# Altium project SAMA5D27-SOM1-EK1_ REVD1.PrjPcb (part 1 of 6)
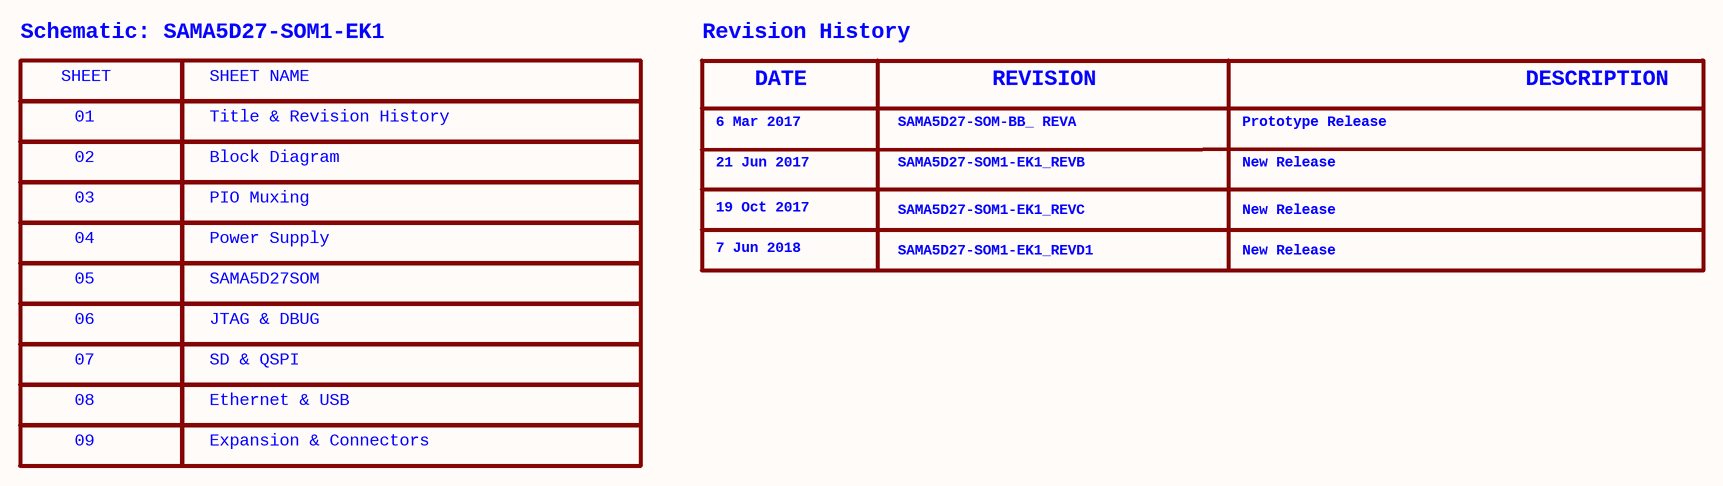
[diagram p0: 01) Title & Revision Hi.SchDoc]
ProjectBoardNumber: 10759; ProjectDrawnBy: Dragos Danaila; ProjectEngineer: Dragos Danaila; ProjectPartNumber: SAMA5D27-SOM1-EK1; ProjectRevisionART: D1; ProjectRevisionASSY: D1; ProjectRevisionFAB: D1; ProjectRevisionSCH: D1; ProjectTitle: SAMA5D27-SOM1-EK1
9 sheets, 305 parts. Net scope: global (net labels, ports and power ports of the same name join across sheets).
Board file: ATM1099C-0627-ssy-5.PcbDoc
Sheets:
  01) Title & Revision Hi.SchDoc
  02) Block Diagram.SchDoc
  03) PIO Muxing.SchDoc
  04) Power Supply.SchDoc
  05) SAMA5D27SOM.SchDoc
  06) JTAG & DBUG.SchDoc
  07) SD & QSPI.SchDoc
  08) Ethernet & USB.SchDoc
  09) Expansion & Connect.SchDoc

## Sheet 01) Title & Revision Hi.SchDoc
size B; CompanyName: Microchip Technology Inc.; Organization: Microchip Technology; Address1: 2355 West Chandler Blvd.; Address2: Chandler, AZ  85224; Address4: USA; DocumentNumber: 1; SheetNumber: 1; SheetTotal: 9; SheetTitle: **; Time: Time

### Parts
(Parts that share a designator on the sheet are numbered #1, #2 ... from top to bottom, then left to right.)
?#1  (no value)  (graphical)

### Notes on the sheet
- Schematic: SAMA5D27-SOM1-EK1
- SHEET
- SHEET NAME
- Revision History
- 01
- Title & Revision History
- 6 Mar 2017
- DATE
- SAMA5D27-SOM-BB_ REVA
- REVISION
- Prototype Release
- DESCRIPTION
- 03
- 02
- PIO Muxing
- Block Diagram
- 21 Jun 2017
- 19 Oct 2017
- SAMA5D27-SOM1-EK1_REVB
- SAMA5D27-SOM1-EK1_REVC
- New Release
- 05
- 04
- Power Supply
- SAMA5D27SOM
- 7 Jun 2018
- SAMA5D27-SOM1-EK1_REVD1
- 06
- JTAG & DBUG
- 08
- 07
- SD & QSPI
- Ethernet & USB
- 09
- Expansion & Connectors
- Drawn By:
- Engineer:
- PartNumber:
- Project Title
- Sheet Title
- Size
- B
- Revision:
- Sch #:
- Date:
- Sheet
- Designed with
- Altium.com <http://go.altium.com/MicrochipLandingPage_Evaluation.html>
- File:

### Library data of the parts
?#1 = Title Block B

## Sheet 02) Block Diagram.SchDoc
size C; SheetTitle: **; CompanyName: Microchip Technology Inc.; Organization: Microchip Technology; Address1: 2355 West Chandler Blvd.; Address2: Chandler, AZ  85224; Address4: USA; DocumentNumber: 2; SheetNumber: 2; SheetTotal: 9; Time: Time
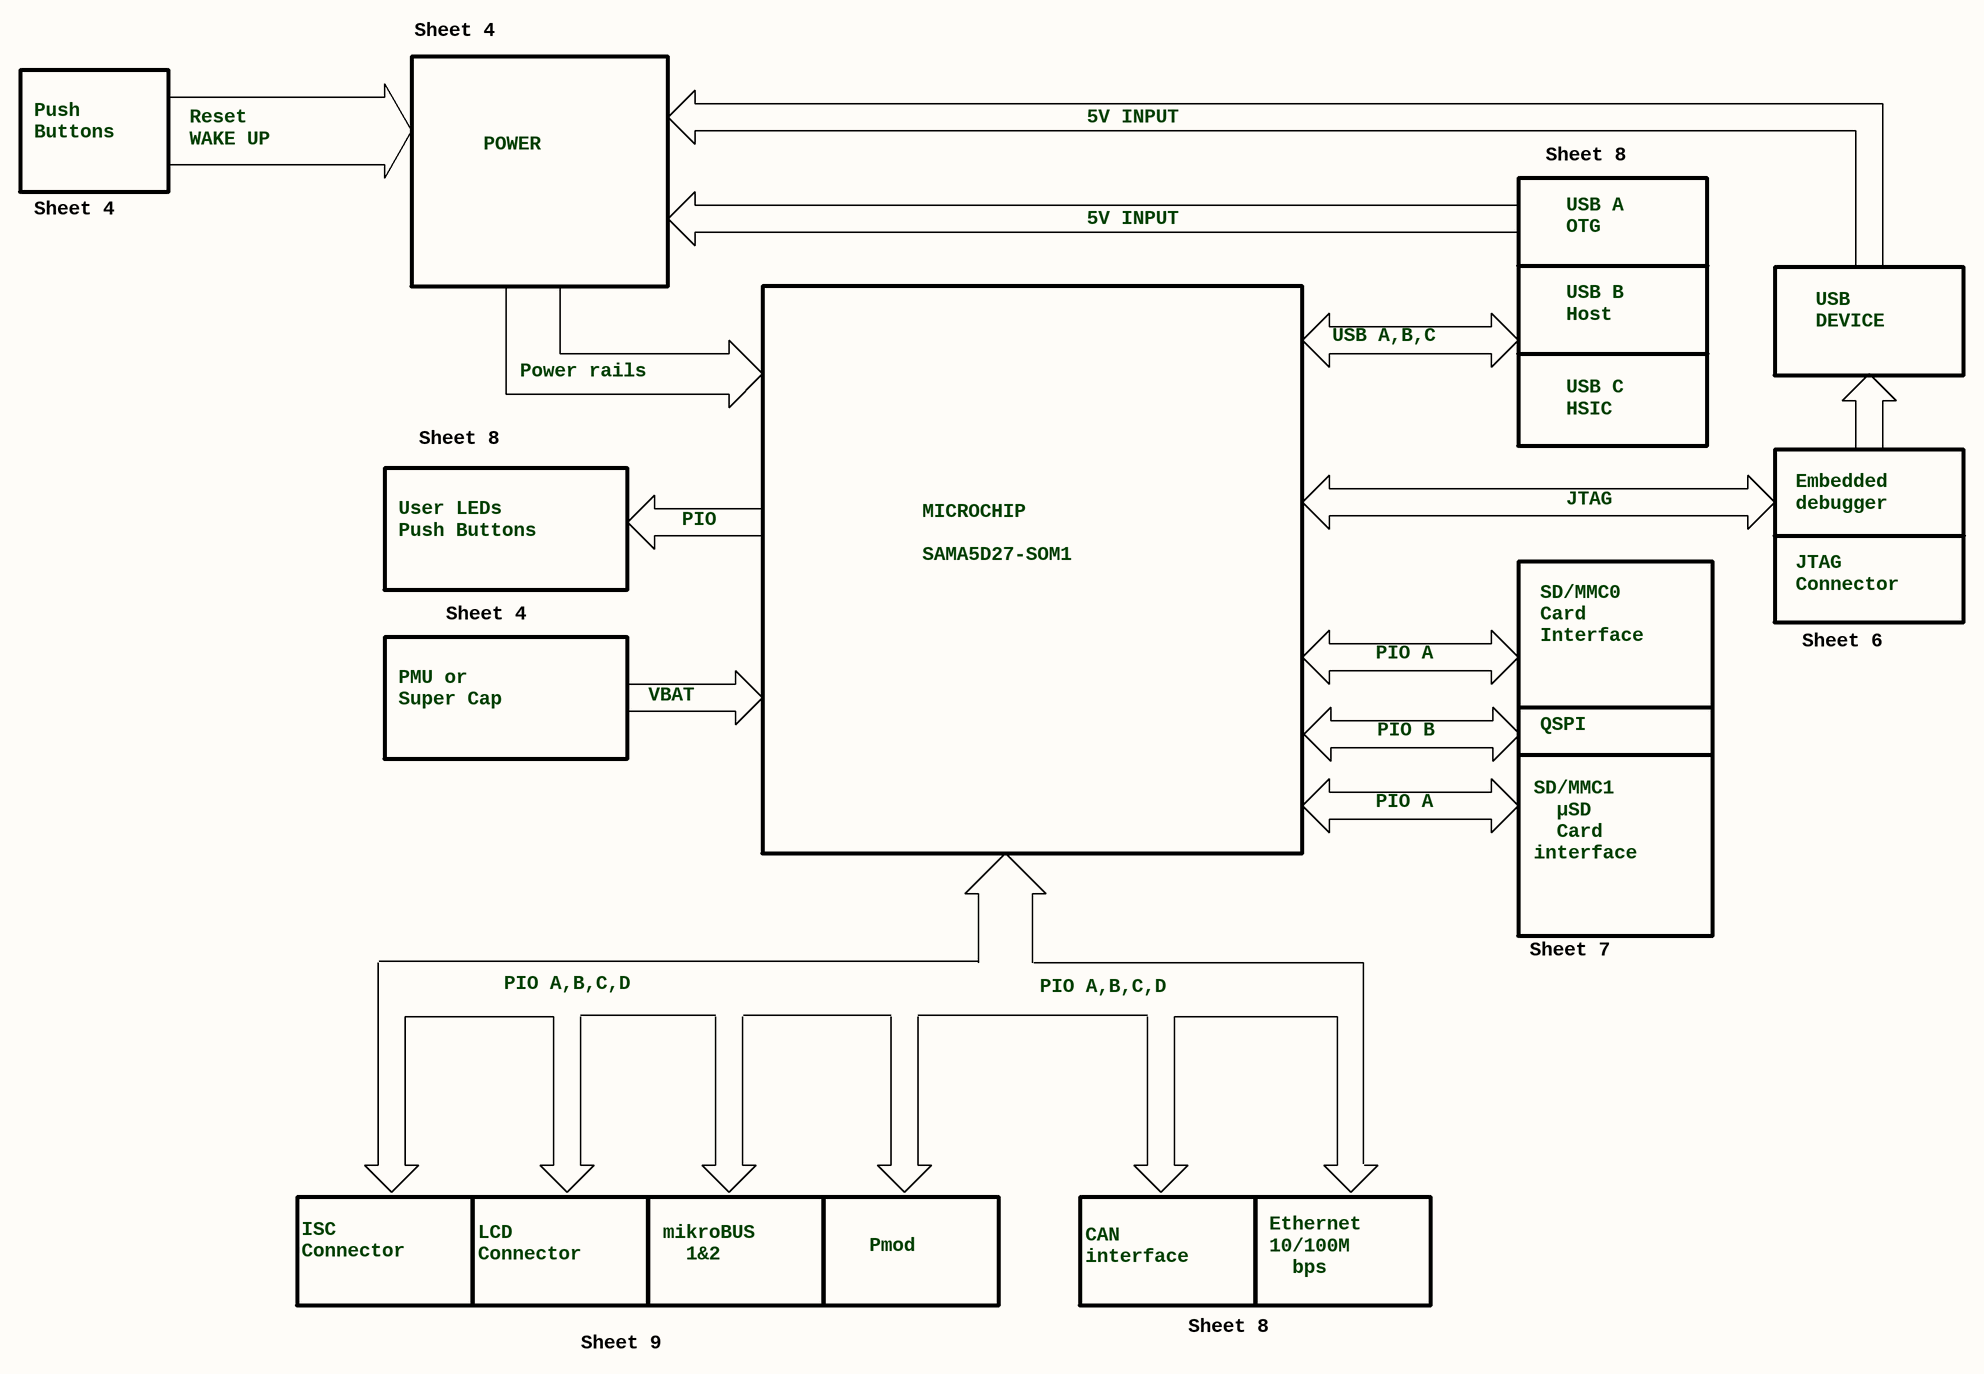
[diagram p1: 02) Block Diagram.SchDoc]

### Parts
(Parts that share a designator on the sheet are numbered #1, #2 ... from top to bottom, then left to right.)
?#2  (no value)  (graphical)

### Notes on the sheet
- Sheet 4
- Push
  Buttons
- Reset
  WAKE UP
- POWER
- 5V INPUT
- Sheet 8
- USB A
  OTG
- USB A,B,C
- USB B
  Host
- USB
  DEVICE
- Power rails
- USB C
  HSIC
- User LEDs
  Push Buttons
- PIO
- JTAG
- Embedded
  debugger
- JTAG
  Connector
- MICROCHIP
  SAMA5D27-SOM1
- PIO A
- SD/MMC0
  Card
  Interface
- Sheet 6
- PMU or
  Super Cap
- VBAT
- PIO B
- QSPI
- SD/MMC1
  µSD
  Card
  interface
- Sheet 7
- PIO A,B,C,D
- ISC
  Connector
- LCD
  Connector
- mikroBUS
  1&2
- Pmod
- CAN
  interface
- Ethernet
  10/100M
  bps
- Sheet 9
- Drawn By:
- Sheet Title
- Engineer:
- PartNumber:
- Project Title
- Designed with
- File:
- Size
- C
- Revision:
- Sch #:
- Date:
- Sheet
- Altium.com <http://go.altium.com/MicrochipLandingPage_Evaluation.html>

### Library data of the parts
?#2 = Title Block C

## Sheet 03) PIO Muxing.SchDoc
size C; SheetTitle: **; CompanyName: Microchip Technology Inc.; Organization: Microchip Technology; Address1: 2355 West Chandler Blvd.; Address2: Chandler, AZ  85224; Address4: USA; DocumentNumber: 3; SheetNumber: 3; SheetTotal: 9; Time: Time
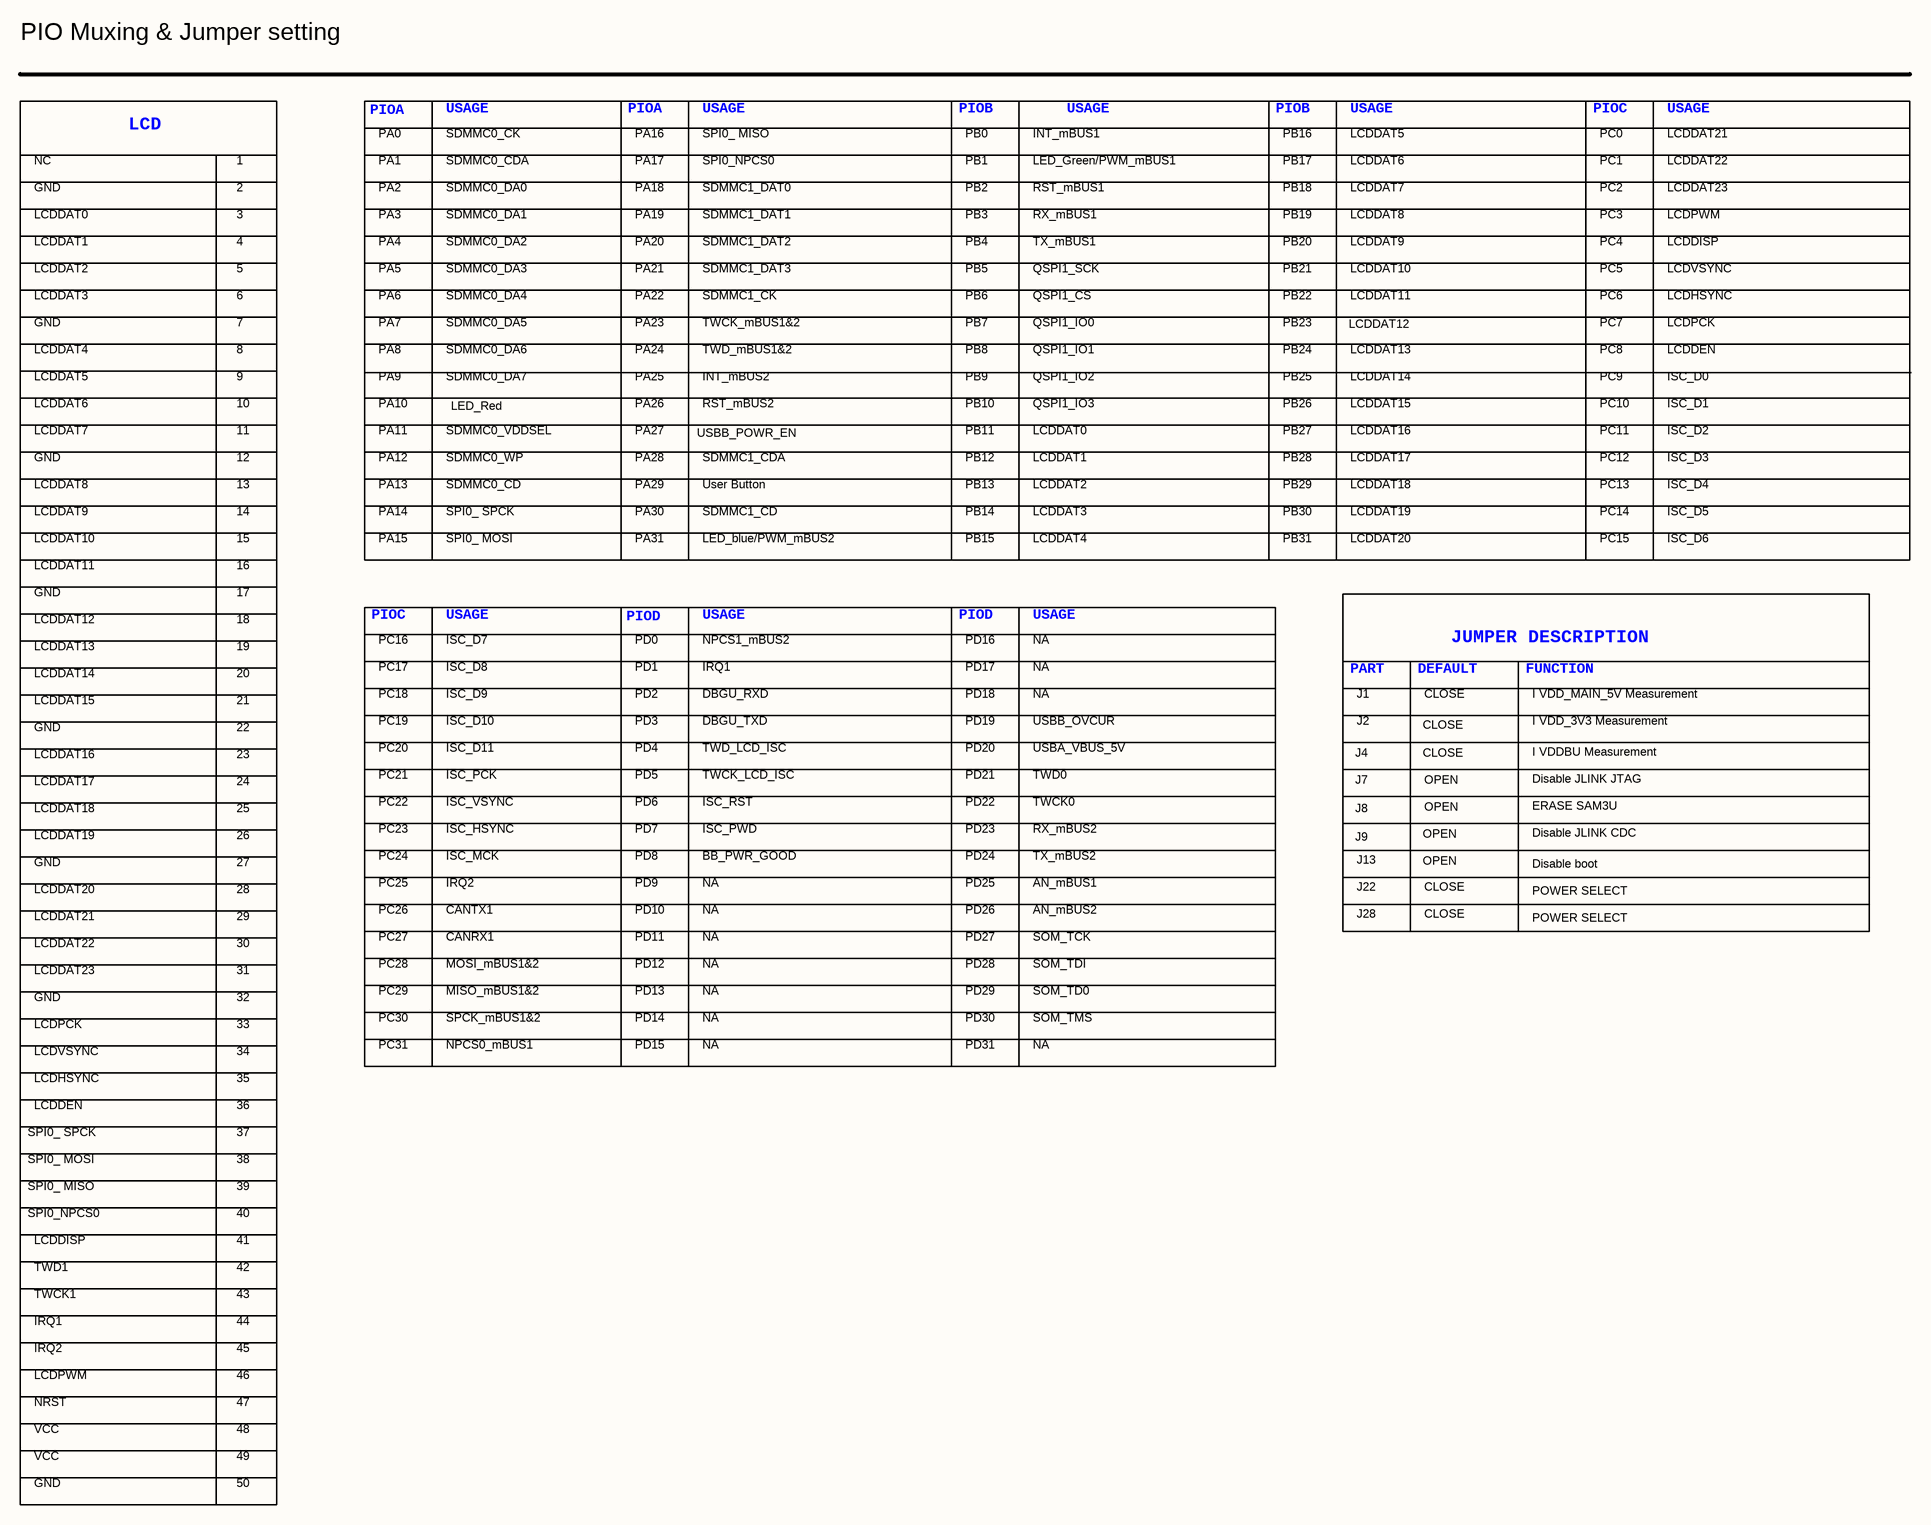
[diagram p2: 03) PIO Muxing.SchDoc]

### Parts
(Parts that share a designator on the sheet are numbered #1, #2 ... from top to bottom, then left to right.)
?#3  (no value)  (graphical)

### Notes on the sheet
- PIO Muxing & Jumper setting
- LCD
- PIOA
- PA0
- SDMMC0_CK
- USAGE
- PA16
- SPI0_ MISO
- PIOB
- PB0
- INT_mBUS1
- PB16
- LCDDAT5
- PIOC
- PC0
- LCDDAT21
- NC
- LCDDAT0
- GND
- 1
- 2
- 3
- PA1
- PA2
- PA3
- SDMMC0_CDA
- SDMMC0_DA1
- SDMMC0_DA0
- PA17
- PA18
- PA19
- SPI0_NPCS0
- SDMMC1_DAT1
- SDMMC1_DAT0
- PB3
- PB1
- PB2
- LED_Green/PWM_mBUS1
- RX_mBUS1
- RST_mBUS1
- PB17
- PB18
- PB19
- LCDDAT6
- LCDDAT8
- LCDDAT7
- PC1
- PC2
- PC3
- LCDPWM
- LCDDAT23
- LCDDAT22
- LCDDAT1
- LCDDAT2
- 4
- 5
- PA4
- PA5
- SDMMC0_DA3
- SDMMC0_DA2
- PA21
- PA20
- SDMMC1_DAT3
- SDMMC1_DAT2
- PB4
- PB5
- QSPI1_SCK
- TX_mBUS1
- PB21
- PB20
- LCDDAT10
- LCDDAT9
- PC5
- PC4
- LCDVSYNC
- LCDDISP
- LCDDAT3
- LCDDAT4
- 6
- 7
- 8
- PA6
- PA7
- PA8
- SDMMC0_DA5
- SDMMC0_DA4
- SDMMC0_DA6
- PA24
- PA23
- PA22
- TWCK_mBUS1&2
- SDMMC1_CK
- TWD_mBUS1&2
- PB6
- PB7
- PB8
- QSPI1_IO0
- QSPI1_CS
- QSPI1_IO1
- PB22
- PB23
- PB24
- LCDDAT12
- LCDDAT11
- LCDDAT13
- PC7
- PC8
- PC6
- LCDDEN
- LCDPCK
- LCDHSYNC
- 9
- 10
- PA9
- PA10
- SDMMC0_DA7
- LED_Red
- PA26
- PA25
- RST_mBUS2
- INT_mBUS2
- PB10
- PB9
- QSPI1_IO2
- QSPI1_IO3
- PB26
- PB25
- LCDDAT15
- LCDDAT14
- PC9
- PC10
- ISC_D1
- ISC_D0
- 11
- 12
- 13
- PA11
- PA12
- PA13
- SDMMC0_WP
- SDMMC0_VDDSEL
- SDMMC0_CD
- PA27
- PA29
- PA28
- USBB_POWR_EN
- SDMMC1_CDA
- User Button
- PB13
- PB12
- PB11
- PB29
- PB28
- PB27
- LCDDAT17
- LCDDAT16
- LCDDAT18
- PC11
- PC12
- PC13
- ISC_D4
- ISC_D2
- ISC_D3
- 14
- 15
- PA14
- PA15
- SPI0_ MOSI
- SPI0_ SPCK
- PA31
- PA30
- LED_blue/PWM_mBUS2
- SDMMC1_CD
- PB15
- PB14
- PB30
- PB31
- LCDDAT20
- LCDDAT19
- PC14
- PC15
- ISC_D6
- ISC_D5
- 16
- 17
- 18
- PIOD
- 19
- 20
- PC16
- PC17
- PC18
- ISC_D9
- ISC_D8
- ISC_D7
- PD0
- PD2
- PD1
- IRQ1
- DBGU_RXD
- NPCS1_mBUS2
- PD16
- PD17
- PD18
- NA
- PART
- J1
- DEFAULT
- CLOSE
- JUMPER DESCRIPTION
- FUNCTION
- I VDD_MAIN_5V Measurement
- 21
- 22
- 23
- PC19
- PC20
- ISC_D11
- ISC_D10
- PD3
- PD4
- DBGU_TXD
- TWD_LCD_ISC
- PD19
- PD20
- USBB_OVCUR
- USBA_VBUS_5V
- J4
- J2
- I VDD_3V3 Measurement
- I VDDBU Measurement
- 24
- 25
- PC21
- PC22
- PC23
- ISC_PCK
- ISC_HSYNC
- ISC_VSYNC
- PD5
- PD6
- PD7
- TWCK_LCD_ISC
- ISC_RST
- ISC_PWD
- PD21
- PD23
- PD22
- TWD0
- TWCK0
- RX_mBUS2
- J7
- J8
- OPEN
- Disable JLINK JTAG
- Disable JLINK CDC
- ERASE SAM3U
- 26
- 27
- 28
- PC24
- PC25
- IRQ2
- ISC_MCK
- PD8
- PD9
- BB_PWR_GOOD
- PD24
- PD25
- AN_mBUS1
- TX_mBUS2
- J9
- J13
- J22
- Disable boot
- POWER SELECT
- 29
- 30
- PC26
- PC27
- PC28
- CANRX1
- MOSI_mBUS1&2
- CANTX1
- PD10
- PD12
- PD11
- PD26
- PD27
- PD28
- SOM_TDI
- SOM_TCK
- AN_mBUS2
- J28
- 31
- 32
- 33
- PC29
- PC30
- SPCK_mBUS1&2
- MISO_mBUS1&2
- PD13
- PD14
- PD30
- PD29
- SOM_TMS
- SOM_TD0
- 34
- 35
- PC31
- NPCS0_mBUS1
- PD15
- PD31
- 36
- 37
- 38
- 39
- 40
- TWD1
- TWCK1
- 41
- 42
- 43
- 44
- 45
- VCC
- NRST
- 46
- 47
- 48
- 49
- 50
- Drawn By:
- Sheet Title
- Engineer:
- PartNumber:
- Project Title
- Designed with
- File:
- Size
- C
- Revision:
- Sch #:
- Date:
- Sheet
- Altium.com <http://go.altium.com/MicrochipLandingPage_Evaluation.html>

### Library data of the parts
?#3 = Title Block C

## Sheet 04) Power Supply.SchDoc
size B; CompanyName: Microchip Technology Inc.; Organization: Microchip Technology; Address1: 2355 West Chandler Blvd.; Address2: Chandler, AZ  85224; Address4: USA; DocumentNumber: 4; SheetNumber: 4; SheetTotal: 9; SheetTitle: **; Time: Time
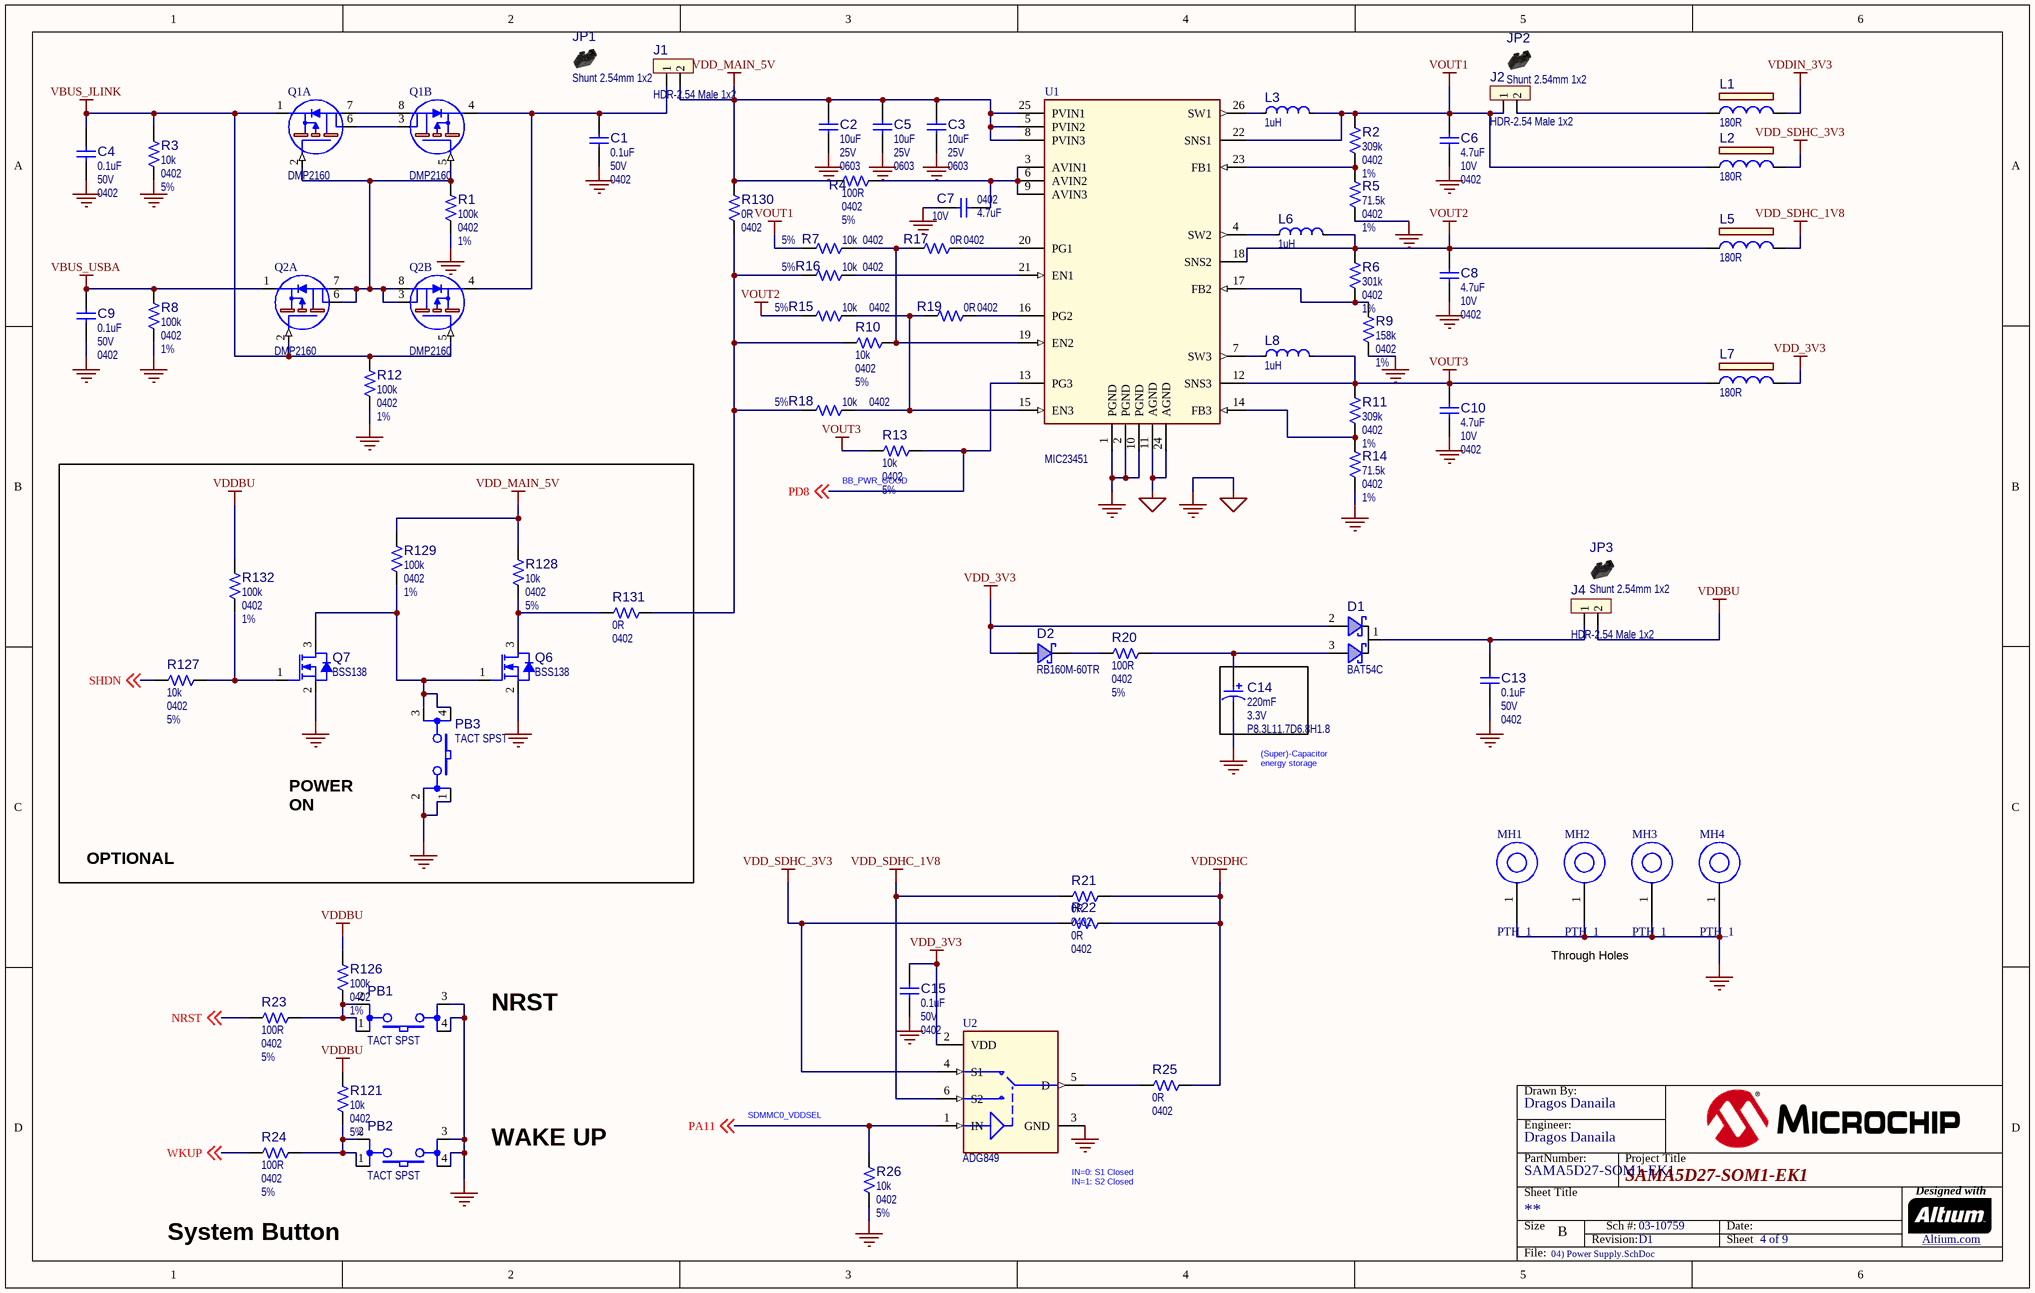
[diagram p3: 04) Power Supply.SchDoc]

### Parts
(Parts that share a designator on the sheet are numbered #1, #2 ... from top to bottom, then left to right.)
?#4  (no value)  (graphical)
C1  value 0.1uF  Voltage: 50V  Package: 0402  [CAP_C_0402]  (hidden comment: Capacitor NP)
C2  value 10uF  Voltage: 25V  Package: 0603  [CAP_C_0603]  (hidden comment: Capacitor NP)
C3  value 10uF  Voltage: 25V  Package: 0603  [CAP_C_0603]  (hidden comment: Capacitor NP)
C4  value 0.1uF  Voltage: 50V  Package: 0402  [CAP_C_0402]  (hidden comment: Capacitor NP)
C5  value 10uF  Voltage: 25V  Package: 0603  [CAP_C_0603]  (hidden comment: Capacitor NP)
C6  value 4.7uF  Voltage: 10V  Package: 0402  [CAP_C_0402]  (hidden comment: Capacitor NP)
C7  value 4.7uF  Voltage: 10V  Package: 0402  [CAP_C_0402]  (hidden comment: Capacitor NP)
C8  value 4.7uF  Voltage: 10V  Package: 0402  [CAP_C_0402]  (hidden comment: Capacitor NP)
C9  value 0.1uF  Voltage: 50V  Package: 0402  [CAP_C_0402]  (hidden comment: Capacitor NP)
C10  value 4.7uF  Voltage: 10V  Package: 0402  [CAP_C_0402]  (hidden comment: Capacitor NP)
C13  value 0.1uF  Voltage: 50V  Package: 0402  [CAP_C_0402]  (hidden comment: Capacitor NP)
C14  value 220mF  Voltage: 3.3V  Package: P8.3L11.7D6.8H1.8  [CAP_AX_P8.3L11.7D6.8H1.8]  (hidden comment: Capacitor POL)
C15  value 0.1uF  Voltage: 50V  Package: 0402  [CAP_C_0402]  (hidden comment: Capacitor NP)
D1  value BAT54C  [SOT-23-3_REVERSED]  (hidden comment: Diode Schottky Dual CK-1)
D2  value RB160M-60TR  [SOD-123FL]  (hidden comment: Diode Schottky)
J1  value HDR-2.54 Male 1x2  [HDR_M_2.54_1x2]  (hidden comment: Header 1x2)
J2  value HDR-2.54 Male 1x2  [HDR_M_2.54_1x2]  (hidden comment: Header 1x2)
J4  value HDR-2.54 Male 1x2  [HDR_M_2.54_1x2]  (hidden comment: Header 1x2)
JP1  value Shunt 2.54mm 1x2  [Jumper_Mechanical]  (hidden comment: Jumper Mechanical)  (mechanical)
JP2  value Shunt 2.54mm 1x2  [Jumper_Mechanical]  (hidden comment: Jumper Mechanical)  (mechanical)
JP3  value Shunt 2.54mm 1x2  [Jumper_Mechanical]  (hidden comment: Jumper Mechanical)  (mechanical)
L1  value 180R  [IND_C_0603]  (hidden comment: Ferrite Bead)
L2  value 180R  [IND_C_0603]  (hidden comment: Ferrite Bead)
L3  value 1uH  [IND_C_1210]  (hidden comment: Inductor)
L5  value 180R  [IND_C_0603]  (hidden comment: Ferrite Bead)
L6  value 1uH  [IND_C_1210]  (hidden comment: Inductor)
L7  value 180R  [IND_C_0603]  (hidden comment: Ferrite Bead)
L8  value 1uH  [IND_C_1210]  (hidden comment: Inductor)
MH1  PTH_1  [HOLE2]  (no BOM)
MH2  PTH_1  [HOLE2]  (no BOM)
MH3  PTH_1  [HOLE2]  (no BOM)
MH4  PTH_1  [HOLE2]  (no BOM)
PB1  value TACT SPST  [SW_SMD_6mmX6mm_TL3301]  (hidden comment: Switch 4 Pin)
PB2  value TACT SPST  [SW_SMD_6mmX6mm_TL3301]  (hidden comment: Switch 4 Pin)
PB3  value TACT SPST  [SW_SMD_6mmX6mm_TL3301]  (hidden comment: Switch 4 Pin)
Q1  value DMP2160  [U-DFN2020-6_2.0x2.0]  (hidden comment: Transistor U-DFN2020-6-SGDSGD)  (parts A,B of 2)
Q2  value DMP2160  [U-DFN2020-6_2.0x2.0]  (hidden comment: Transistor U-DFN2020-6-SGDSGD)  (parts A,B of 2)
Q6  value BSS138  [SOT-23-3]  (hidden comment: Transistor MOS-N GSD)
Q7  value BSS138  [SOT-23-3]  (hidden comment: Transistor MOS-N GSD)
R1  value 100k  Package: 0402  Tolerance: 1%  [RES_C_0402]  (hidden comment: Resistor)
R2  value 309k  Package: 0402  Tolerance: 1%  [RES_C_0402]  (hidden comment: Resistor)
R3  value 10k  Package: 0402  Tolerance: 5%  [RES_C_0402]  (hidden comment: Resistor)
R4  value 100R  Package: 0402  Tolerance: 5%  [RES_C_0402]  (hidden comment: Resistor)
R5  value 71.5k  Package: 0402  Tolerance: 1%  [RES_C_0402]  (hidden comment: Resistor)
R6  value 301k  Package: 0402  Tolerance: 1%  [RES_C_0402]  (hidden comment: Resistor)
R7  value 10k  Package: 0402  Tolerance: 5%  [RES_C_0402]  (hidden comment: Resistor)
R8  value 100k  Package: 0402  Tolerance: 1%  [RES_C_0402]  (hidden comment: Resistor)
R9  value 158k  Package: 0402  Tolerance: 1%  [RES_C_0402]  (hidden comment: Resistor)
R10  value 10k  Package: 0402  Tolerance: 5%  [RES_C_0402]  (hidden comment: Resistor)
R11  value 309k  Package: 0402  Tolerance: 1%  [RES_C_0402]  (hidden comment: Resistor)
R12  value 100k  Package: 0402  Tolerance: 1%  [RES_C_0402]  (hidden comment: Resistor)
R13  value 10k  Package: 0402  Tolerance: 5%  [RES_C_0402]  (hidden comment: Resistor)
R14  value 71.5k  Package: 0402  Tolerance: 1%  [RES_C_0402]  (hidden comment: Resistor)
R15  value 10k  Package: 0402  Tolerance: 5%  [RES_C_0402]  (hidden comment: Resistor)
R16  value 10k  Package: 0402  Tolerance: 5%  [RES_C_0402]  (hidden comment: Resistor)
R17  value 0R  Package: 0402  [RES_C_0402]  (hidden comment: Resistor)
R18  value 10k  Package: 0402  Tolerance: 5%  [RES_C_0402]  (hidden comment: Resistor)
R19  value 0R  Package: 0402  [RES_C_0402]  (hidden comment: Resistor)
R20  value 100R  Package: 0402  Tolerance: 5%  [RES_C_0402]  (hidden comment: Resistor)
R21  value 0R  Package: 0402  [RES_C_0402]  (hidden comment: Resistor)
R22  value 0R  Package: 0402  [RES_C_0402]  (hidden comment: Resistor)
R23  value 100R  Package: 0402  Tolerance: 5%  [RES_C_0402]  (hidden comment: Resistor)
R24  value 100R  Package: 0402  Tolerance: 5%  [RES_C_0402]  (hidden comment: Resistor)
R25  value 0R  Package: 0402  [RES_C_0402]  (hidden comment: Resistor)
R26  value 10k  Package: 0402  Tolerance: 5%  [RES_C_0402]  (hidden comment: Resistor)
R121  value 10k  Package: 0402  Tolerance: 5%  [RES_C_0402]  (hidden comment: Resistor)
R126  value 100k  Package: 0402  Tolerance: 1%  [RES_C_0402]  (hidden comment: Resistor)
R127  value 10k  Package: 0402  Tolerance: 5%  [RES_C_0402]  (hidden comment: Resistor)
R128  value 10k  Package: 0402  Tolerance: 5%  [RES_C_0402]  (hidden comment: Resistor)
R129  value 100k  Package: 0402  Tolerance: 1%  [RES_C_0402]  (hidden comment: Resistor)
R130  value 0R  Package: 0402  [RES_C_0402]  (hidden comment: Resistor)
R131  value 0R  Package: 0402  [RES_C_0402]  (hidden comment: Resistor)
R132  value 100k  Package: 0402  Tolerance: 1%  [RES_C_0402]  (hidden comment: Resistor)
U1  value MIC23451  [VQFN-26_4X4_MIC23451]  (hidden comment: MIC23451 VQFN-26)
U2  value ADG849  [SC-70-6]  (hidden comment: ADG849 SC70)

### Blocks framed on the sheet
OPTIONAL: PB3 Q6 Q7 R127-R129 R131 R132

### Nets
GND_POWER: C1.2 C2.2 C3.2 C4.2 C5.2 C6.2 C7.2 C8.2 C9.2 C10.2 C13.2 C14.2 C15.2 MH1.1 MH2.1 MH3.1 MH4.1 PB1.3 PB1.4 PB2.3 PB2.4 PB3.1 PB3.2 Q6.2(S) Q7.2(S) R1.2 R3.1 R5.2 R8.2 R9.2 R12.2 R14.2 R26.1 U1.1(PGND) U1.2(PGND) U1.10(PGND) U1.11(AGND) U1.24(AGND) U2.3(GND)  [also labelled GND_SIGNAL]  [project net GND]
VBUS_JLINK: C4.1 Q1.1(S2) Q2.2(G2) Q2.5(G2) R3.2 R12.1
VBUS_USBA: C9.1 Q2.1(S2) R8.1
VDD_3V3: C15.1 D1.2(A) D2.1(A) L7.2 U2.2(VDD)
VDD_MAIN_5V: C2.1 C3.1 C5.1 J1.2 R4.1 R128.2 R129.1 R130.2 U1.5(PVIN2) U1.8(PVIN3) U1.25(PVIN1)
VDD_SDHC_1V8: L5.2 R21.1 U2.6(S2)
VDD_SDHC_3V3: L2.2 R22.1 U2.4(S1)
VDDBU: J4.2 R121.1 R126.1 R132.1
VDDIN_3V3: L1.2
VDDSDHC: R21.2 R22.2 R25.2
VOUT1: C6.1 J2.1 L2.1 L3.2(F) R2.1 R7.1 U1.22(SNS1)
VOUT2: C8.1 L5.1 L6.2(F) R6.1 R15.2 U1.18(SNS2)
VOUT3: C10.1 L7.1 L8.2(F) R11.1 R13.1 U1.12(SNS3)
NRST: R23.1 ; off-sheet NRST
PA11: R26.2 U2.1(IN) ; off-sheet PA11
PD8: R13.2 U1.13(PG3) ; off-sheet PD8
SHDN: R127.1 ; off-sheet SHDN
WKUP: R24.1 ; off-sheet WKUP
NetC1_1: C1.1 J1.1 Q1.4(S2) Q2.4(S2)
NetC7_1: C7.1 R4.2 U1.3(AVIN1) U1.6(AVIN2) U1.9(AVIN3)
NetC13_1: C13.1 D1.1(KK) J4.1
NetC14_1: C14.1 D1.3(A) R20.2
NetD2_2: D2.2(K) R20.1
NetJ2_2: J2.2 L1.1
NetL3_1: L3.1(S) U1.26(SW1)
NetL6_1: L6.1(S) U1.4(SW2)
NetL8_1: L8.1(S) U1.7(SW3)
NetPB1_1: PB1.1 PB1.2 R23.2 R126.2
NetPB2_1: PB2.1 PB2.2 R24.2 R121.2
NetPB3_3: PB3.3 PB3.4 Q6.1(G) Q7.3(D) R129.2
NetQ1_2: Q1.2(G2) Q1.5(G2) Q2.3(D2_1) Q2.6(D2_1) Q2.7(D2_2) Q2.8(D2_2) R1.1
NetQ1_3: Q1.3(D2_1) Q1.6(D2_1)
NetQ1_7: Q1.7(D2_2) Q1.8(D2_2)
NetQ6_3: Q6.3(D) R128.1 R131.1
NetQ7_1: Q7.1(G) R127.2 R132.2
NetR2_2: R2.2 R5.1 U1.23(FB1)
NetR6_2: R6.2 R9.1 U1.17(FB2)
NetR7_2: R7.2 R10.2 R17.1 U1.19(EN2)
NetR10_1: R10.1 R16.1 R18.2 R130.1 R131.2
NetR11_2: R11.2 R14.1 U1.14(FB3)
NetR15_1: R15.1 R18.1 R19.1 U1.15(EN3)
NetR16_2: R16.2 U1.21(EN1)
NetR17_2: R17.2 U1.20(PG1)
NetR19_2: R19.2 U1.16(PG2)
NetR25_1: R25.1 U2.5(D)

### Notes on the sheet
- (near R13) BB_PWR_GOOD
- (Super)-Capacitor
  energy storage
- (near PB3) POWER
  ON
- Through Holes
- NRST
- WAKE UP
- SDMMC0_VDDSEL
- System Button
- (near U2) IN=0: S1 Closed
  IN=1: S2 Closed
- Drawn By:
- Engineer:
- PartNumber:
- Project Title
- Sheet Title
- Size
- B
- Revision:
- Sch #:
- Date:
- Sheet
- Designed with
- Altium.com <http://go.altium.com/MicrochipLandingPage_Evaluation.html>
- File:

### Library data of the parts
?#4 = Title Block B
C1 C4 C9 C13 C15 = CAP1463: Capacitor; Manufacturer 1: TDK Corporation; Manufacturer Part Number 1: C1005X7R1H104K050BB; Description_: CAP CER 0.1uF 50V 10% X7R SMD 0402; Dev Tools Status: Production; Tolerance: 10%; Temperature Coeffcient: X7R; Type: Ceramic; Owner: Jamus Griego; Populated: YES; MCHP-ID: CAP1463; Revision: 1; Symbol: Capacitor NP; Status: MCL Design; ComponentLink1URL: https://chn-vm-apps.microchip.com/mchprepo/parts/Datasheets/TDKMLCCCapRange.pdf; ComponentLink1Description: SVN Datasheet; ComponentLink2URL: C:\ALTIUM_WORK\00001_MCHP-CDB\Datasheets\TDKMLCCCapRange.pdf; ComponentLink2Description: Local Datasheet; ComponentLink3URL: C:\ALTIUM_WORK\00001_MCHP-CDB\Library\LibraryRefs\Capacitor NP.SchLib; ComponentLink3Description: Open Symbol; ComponentLink4URL: C:\ALTIUM_WORK\00001_MCHP-CDB\Library\Footprints\CAP_C_0402.PcbLib; ComponentLink4Description: Open Footprint; ComponentLink5Description: Open Footprint 2; ComponentLink6Description: Open Footprint 3; ComponentLink7Description: Open Footprint 4; Operating Temperature: -55C to +125C; Category: Capacitor; Supplier 1: Digi-Key; Supplier Part Number 1: 445-5932-1-ND; Quantity Override: 1
C2 C3 C5 = CAP1650: Capacitor; Manufacturer 1: TDK Corporation; Manufacturer Part Number 1: C1608X5R1E106M080AC; Description_: CAP CER 10uF 25V 20% X5R SMD 0603; Dev Tools Status: Design; Tolerance: 20%; Temperature Coeffcient: X5R; Type: Ceramic; Owner: Razvan Cristescu; Populated: YES; MCHP-ID: CAP1650; Revision: A; Symbol: Capacitor NP; Status: MCL Design; ComponentLink1URL: https://chn-vm-apps.microchip.com/mchprepo/parts/Datasheets/1913358.pdf; ComponentLink1Description: SVN Datasheet; ComponentLink2URL: C:\ALTIUM_WORK\00001_MCHP-CDB\Datasheets\1913358.pdf; ComponentLink2Description: Local Datasheet; ComponentLink3URL: C:\ALTIUM_WORK\00001_MCHP-CDB\Library\LibraryRefs\Capacitor NP.SchLib; ComponentLink3Description: Open Symbol; ComponentLink4URL: C:\ALTIUM_WORK\00001_MCHP-CDB\Library\Footprints\CAP_C_0603.PcbLib; ComponentLink4Description: Open Footprint; ComponentLink5Description: Open Footprint 2; ComponentLink6Description: Open Footprint 3; ComponentLink7Description: Open Footprint 4; Operating Temperature: -55C to +85C; Category: Capacitor; Supplier 1: Farnell; Supplier Part Number 1: 2521968; Quantity Override: 1
C6-C8 C10 = CAP1684: Capacitor; Manufacturer 1: TDK Corporation; Manufacturer Part Number 1: C1005X5R1A475K050BC; Description_: CAP CER 4.7uF 10V 10% X5R SMD 0402; Dev Tools Status: Design; Tolerance: 10%; Temperature Coeffcient: X5R; Type: Ceramic; Owner: Jesus Aviles; Populated: YES; MCHP-ID: CAP1684; Revision: B; Symbol: Capacitor NP; Status: MCL Design; ComponentLink1Description: SVN Datasheet; ComponentLink2Description: Local Datasheet; ComponentLink3URL: C:\ALTIUM_WORK\00001_MCHP-CDB\Library\LibraryRefs\Capacitor NP.SchLib; ComponentLink3Description: Open Symbol; ComponentLink4URL: C:\ALTIUM_WORK\00001_MCHP-CDB\Library\Footprints\CAP_C_0402.PcbLib; ComponentLink4Description: Open Footprint; ComponentLink5Description: Open Footprint 2; ComponentLink6Description: Open Footprint 3; ComponentLink7Description: Open Footprint 4; Operating Temperature: -55C to 85C; Category: Capacitor; Supplier 1: Digi-Key; Supplier Part Number 1: 445-13820-1-ND; Quantity Override: 1
C14 = CAP1762: Capacitor; Manufacturer 1: Elna America; Manufacturer Part Number 1: DSK-3R3H204T614-H2L; Description_: CAP SUPERCAP 200mF 3.3V -20% +80% 200Ohm AX P8.3L11.7D6.8H1.8; Dev Tools Status: Design; Tolerance: -20%, +80%; ESR: 200R; Type: Supercap; Owner: Alexandru Chiser - M19201; Populated: YES; MCHP-ID: CAP1762; Revision: A; Symbol: Capacitor POL; Status: MCL Design; ComponentLink1URL: https://chn-vm-apps.microchip.com/mchprepo/parts/Datasheets/ds_e.pdf; ComponentLink1Description: SVN Datasheet; ComponentLink2URL: C:\ALTIUM_WORK\00001_MCHP-CDB\Datasheets\ds_e.pdf; ComponentLink2Description: Local Datasheet; ComponentLink3URL: C:\ALTIUM_WORK\00001_MCHP-CDB\Library\LibraryRefs\Capacitor POL.SchLib; ComponentLink3Description: Open Symbol; ComponentLink4URL: C:\ALTIUM_WORK\00001_MCHP-CDB\Library\Footprints\CAP_AX_P8.3L11.7D6.8H1.8.PcbLib; ComponentLink4Description: Open Footprint; ComponentLink5Description: Open Footprint 2; ComponentLink6Description: Open Footprint 3; ComponentLink7Description: Open Footprint 4; Operating Temperature: -10C to +60C; Category: Capacitor; Supplier 1: Digi-Key; Supplier Part Number 1: 604-1147-1-ND; Quantity Override: 1
D1 = DIODE0056: Manufacturer 1: Diodes Incorporated; Manufacturer Part Number 1: BAT54CTA; Description_: DIO SCTKYARR BAT54C 530mV 200mA 30V SOT-23-3; Dev Tools Status: Production; Type: Schottky Array; Forward Current: 200mA; Power: 330mW; Reverse Current: 2.5uA; Reverse Voltage: 30V; Populated: Yes; MCHP-ID: DIODE0056; Revision: 1; Symbol: Diode Schottky Dual CK-1; Status: MCL Design; Package: SOT-23-3; ComponentLink1URL: https://chn-vm-apps.microchip.com/mchprepo/parts/Datasheets/bat54srs.pdf; ComponentLink1Description: SVN Datasheet; ComponentLink2URL: C:\ALTIUM_WORK\00001_MCHP-CDB\Datasheets\bat54srs.pdf; ComponentLink2Description: Local Datasheet; ComponentLink3URL: C:\ALTIUM_WORK\00001_MCHP-CDB\Library\LibraryRefs\Diode Schottky Dual CK-1.SchLib; ComponentLink3Description: Open Symbol; ComponentLink4URL: C:\ALTIUM_WORK\00001_MCHP-CDB\Library\Footprints\SOT-23-3_REVERSED.PcbLib; ComponentLink4Description: Open Footprint; ComponentLink5Description: Open Footprint 2; ComponentLink6Description: Open Footprint 3; ComponentLink7Description: Open Footprint 4; Operating Temperature: -55C to +150C; Category: Diode; Supplier 1: Digi-Key; Supplier Part Number 1: BAT54CTR-ND; Quantity Override: 1; Manufacturer 2: Fairchild; Manufacturer Part Number 2: BAT54C; Manufacturer 3: Diodes Incorporated; Manufacturer Part Number 3: UBAT54CTA; Manufacturer 4: STMicroelectronics; Manufacturer Part Number 4: BAT54C; Supplier 2: Digi-Key; Supplier Part Number 2: BAT54CFSTR-ND; Supplier 3: Diodes Incorporated; Supplier Part Number 3: UBAT54CTA; Supplier 4: STMicroelectronics; Supplier Part Number 4: BAT54C
D2 = DIODE1357: DIO SCTKY RB160M-60TR 550mV 1A 60V SMD SOD-123F; Manufacturer 1: Rohm Semiconductor; Dev Tools Status: Design; Power: 1W; Reverse Current: 50uA; Reverse Recovery Time: 11.7ns; Owner: Dragos Danaila; Populated: YES; MCHP-ID: DIODE1357; Revision: A; Symbol: Diode Schottky; Description_: DIO SCTKY RB160M-60TR 550mV 1A 60V SMD SOD-123F; Status: MCL Design; Package: SOD-123-2; ComponentLink1URL: https://chn-vm-apps.microchip.com/mchprepo/parts/Datasheets/rb160m-60-210199.pdf; ComponentLink1Description: SVN Datasheet; ComponentLink2URL: C:\ALTIUM_WORK\00001_MCHP-CDB\Datasheets\rb160m-60-210199.pdf; ComponentLink2Description: Local Datasheet; ComponentLink3URL: C:\ALTIUM_WORK\00001_MCHP-CDB\Library\LibraryRefs\Diode Schottky.SchLib; ComponentLink3Description: Open Symbol; ComponentLink4URL: C:\ALTIUM_WORK\00001_MCHP-CDB\Library\Footprints\SOD-123FL.PcbLib; ComponentLink4Description: Open Footprint; ComponentLink5Description: Open Footprint 2; ComponentLink6Description: Open Footprint 3; ComponentLink7Description: Open Footprint 4; Operating Temperature: -40C to +150C; Category: Diode; Forward Current: 1A; Reverse Voltage: 60V; Manufacturer Part Number 1: RB160M-60TR; Supplier 1: Mouser; Supplier Part Number 1: 755-RB160M-60TR; Quantity Override: 1
J1 J2 J4 = CON1108: Manufacturer 1: FCI; Manufacturer Part Number 1: 77311-118-02LF; Description_: CON HDR-2.54 Male 1x2 Gold 5.84MH TH VERT; Dev Tools Status: Production; Owner: Bogdan P (M91398); Populated: Yes; MCHP-ID: CON1108; Revision: 1; Symbol: Header 1x2; Status: MCL Design; ComponentLink1URL: https://chn-vm-apps.microchip.com/mchprepo/parts/Datasheets/77311.pdf; ComponentLink1Description: SVN Datasheet; ComponentLink2URL: C:\ALTIUM_WORK\00001_MCHP-CDB\Datasheets\77311.pdf; ComponentLink2Description: Local Datasheet; ComponentLink3URL: C:\ALTIUM_WORK\00001_MCHP-CDB\Library\LibraryRefs\Header 1x2.SchLib; ComponentLink3Description: Open Symbol; ComponentLink4URL: C:\ALTIUM_WORK\00001_MCHP-CDB\Library\Footprints\HDR_M_2.54_1x2.PcbLib; ComponentLink4Description: Open Footprint; ComponentLink5Description: Open Footprint 2; ComponentLink6Description: Open Footprint 3; ComponentLink7Description: Open Footprint 4; Type: Header 2.54mm; Category: Connector; Manufacturer 2: FCI; Manufacturer Part Number 2: 68001-202HLF; Manufacturer 3: FCI; Manufacturer Part Number 3: 68000-202HLF; Manufacturer 4: Samtec; Manufacturer Part Number 4: TSW-102-07-G-S; Manufacturer 5: Sullins; Manufacturer Part Number 5: PBC02SAAN; Manufacturer 6: SPC Technology; Manufacturer Part Number 6: SPC20481; Manufacturer 7: Samtec; Manufacturer Part Number 7: TSW-102-07-F-S; Manufacturer 8: Nextron; Manufacturer Part Number 8: R-211-0211-0021-000; Manufacturer 9: Samtec; Manufacturer Part Number 9: TSW-102-07-S-S; Supplier 1: Digi-Key; Supplier Part Number 1: 609-4434-ND; Supplier 2: Digi-Key; Supplier Part Number 2: 609-3469-ND; Supplier 3: Digi-Key; Supplier Part Number 3: 609-3502-ND; Supplier 4: Digi-Key; Supplier Part Number 4: SAM1029-02-ND; Supplier 5: Digi-Key; Supplier Part Number 5: S1011E-02-ND; Supplier 6: Newark; Supplier Part Number 6: 93K5734; Supplier 7: Newark; Supplier Part Number 7: 79P3146; Supplier 8: Raynen; Supplier Part Number 8: R-211-0211-0021-000; Supplier 9: Samtec; Supplier Part Number 9: TSW-102-07-S-S; Quantity Override: 1
JP1-JP3 = HW1006: Manufacturer 1: 3M; Manufacturer Part Number 1: 969102-0000-DA; MCHP-ID: HW1006; Description_: MECH HW JUMPER 2.54mm 1x2; Dev Tools Status: Production; Owner: Mike Ragsdale; Populated: MECH; Revision: 1; Symbol: Jumper Mechanical; Status: MCL Design; ComponentLink1URL: https://chn-vm-apps.microchip.com/mchprepo/parts/Datasheets/63429.pdf; ComponentLink1Description: SVN Datasheet; ComponentLink2URL: C:\ALTIUM_WORK\00001_MCHP-CDB\Datasheets\63429.pdf; ComponentLink2Description: Local Datasheet; ComponentLink3URL: C:\ALTIUM_WORK\00001_MCHP-CDB\Library\LibraryRefs\Jumper Mechanical.SchLib; ComponentLink3Description: Open Symbol; ComponentLink4URL: C:\ALTIUM_WORK\00001_MCHP-CDB\Library\Footprints\Jumper_Mechanical.PcbLib; ComponentLink4Description: Open Footprint; ComponentLink5Description: Open Footprint 2; ComponentLink6Description: Open Footprint 3; ComponentLink7Description: Open Footprint 4; Type: Jumper; Category: Hardware; Manufacturer 2: FCI; Manufacturer Part Number 2: 63429-202LF; Manufacturer 3: Harwin; Manufacturer Part Number 3: M7567-05; Manufacturer 4: Sullins; Manufacturer Part Number 4: SSC02SYAN; Manufacturer 5: Tyco Electronics (TE Connectivity); Manufacturer Part Number 5: 382811-6; Manufacturer 6: Tyco Electronics (TE Connectivity); Manufacturer Part Number 6: 2-382811-1; Manufacturer 7: Samtec; Manufacturer Part Number 7: SNT-100-BK-G; Manufacturer 8: Sullins Connector Solutions; Manufacturer Part Number 8: STC02SYAN; Manufacturer 9: Sullins Connector Solutions; Manufacturer Part Number 9: SPC02SVGN-RC; Supplier 1: Digi-Key; Supplier Part Number 1: 3M9580-ND; Supplier 2: Digi-Key; Supplier Part Number 2: 609-2997-ND; Supplier 3: Digi-Key; Supplier Part Number 3: M7567-05-ND; Supplier 4: Digi-Key; Supplier Part Number 4: S9002-ND; Supplier 5: Digi-Key; Supplier Part Number 5: A26227-ND; Supplier 6: Digi-Key; Supplier Part Number 6: A31697-ND; Supplier 7: Samtec; Supplier Part Number 7: SNT-100-BK-G; Supplier 8: Digi-Key; Supplier Part Number 8: S9000-ND; Supplier 9: Digi-Key; Supplier Part Number 9: S9338-ND; Quantity Override: 1
L1 L2 L5 L7 = IND1453: FERRITE 180R 1.5A SMD 0603; Manufacturer 1: Murata Electronics North America; Manufacturer Part Number 1: BLM18PG181SN1D; Dev Tools Status: Design; Owner: Dragos Danaila; DCR: 0.09R; Test Frequency: 100MHz; Populated: YES; MCHP-ID: IND1453; Revision: A; Symbol: Ferrite Bead; Description_: FERRITE 180R 1.5A SMD 0603; Status: MCL Design; ComponentLink1URL: https://chn-vm-apps.microchip.com/mchprepo/parts/Datasheets/ENFA0003.pdf; ComponentLink1Description: SVN Datasheet; ComponentLink2URL: C:\ALTIUM_WORK\00001_MCHP-CDB\Datasheets\ENFA0003.pdf; ComponentLink2Description: Local Datasheet; ComponentLink3URL: C:\ALTIUM_WORK\00001_MCHP-CDB\Library\LibraryRefs\Ferrite Bead.SchLib; ComponentLink3Description: Open Symbol; ComponentLink4URL: C:\ALTIUM_WORK\00001_MCHP-CDB\Library\Footprints\IND_C_0603.PcbLib; ComponentLink4Description: Open Footprint; ComponentLink5Description: Open Footprint 2; ComponentLink6Description: Open Footprint 3; ComponentLink7Description: Open Footprint 4; Operating Temperature: -55C to +125C; Package: 0603; Type: Ferrite Bead; Category: Inductor; Saturation Current: 1.5A; Supplier 1: Digi-Key; Supplier Part Number 1: 490-5263-1-ND; Quantity Override: 1
L3 L6 L8 = IND1454: Manufacturer 1: Taiyo Yuden; Manufacturer Part Number 1: BRL3225T1R0M; Description_: INDUCTOR 1uH 2.2A 20% SMD 1210; Dev Tools Status: Design; Owner: Dragos Danaila; DCR: 0.0516R; Saturation Current: 2.4A; RMS Current: 2.2A; Test Frequency: 100kHz; Populated: YES; MCHP-ID: IND1454; Revision: A; Symbol: Inductor; Status: MCL Design; ComponentLink1URL: https://chn-vm-apps.microchip.com/mchprepo/parts/Datasheets/wound07_e.pdf; ComponentLink1Description: SVN Datasheet; ComponentLink2URL: C:\ALTIUM_WORK\00001_MCHP-CDB\Datasheets\wound07_e.pdf; ComponentLink2Description: Local Datasheet; ComponentLink3URL: C:\ALTIUM_WORK\00001_MCHP-CDB\Library\LibraryRefs\Inductor.SchLib; ComponentLink3Description: Open Symbol; ComponentLink4URL: C:\ALTIUM_WORK\00001_MCHP-CDB\Library\Footprints\IND_C_1210.PcbLib; ComponentLink4Description: Open Footprint; ComponentLink5Description: Open Footprint 2; ComponentLink6Description: Open Footprint 3; ComponentLink7Description: Open Footprint 4; Operating Temperature: -40C to +105C; Package: 1210; Type: Inductor; Category: Inductor; Supplier 1: Digi-Key; Supplier Part Number 1: 587-2164-1-ND; Quantity Override: 1
PB1-PB3 = SWITCH0003: Switch; Manufacturer 1: E-Switch; Manufacturer Part Number 1: TL3301NF260QG/TR; Description_: SWITCH TACT SPST 12V 50mA TL3301NF160QG/TR SMD; Dev Tools Status: Production; Voltage: 12V; Current: 50mA; Populated: Yes; MCHP-ID: SWITCH0003; Revision: 2; Symbol: Switch 4 Pin; Status: MCL Design; ComponentLink1URL: https://chn-vm-apps.microchip.com/mchprepo/parts/Datasheets/TL3301.pdf; ComponentLink1Description: SVN Datasheet; ComponentLink2URL: C:\ALTIUM_WORK\00001_MCHP-CDB\Datasheets\TL3301.pdf; ComponentLink2Description: Local Datasheet; ComponentLink3URL: C:\ALTIUM_WORK\00001_MCHP-CDB\Library\LibraryRefs\Switch 4 Pin.SchLib; ComponentLink3Description: Open Symbol; ComponentLink4URL: C:\ALTIUM_WORK\00001_MCHP-CDB\Library\Footprints\SW_SMD_6mmX6mm_TL3301.PcbLib; ComponentLink4Description: Open Footprint; ComponentLink5Description: Open Footprint 2; ComponentLink6Description: Open Footprint 3; ComponentLink7Description: Open Footprint 4; Operating Temperature: -20C to +70C; Category: Switch; Type: Tactile; Manufacturer 2: E-Switch; Manufacturer Part Number 2: TL3301NF260QG; Manufacturer 3: E-Switch; Manufacturer Part Number 3: TL3301NF160QG/TR; Manufacturer 4: OMRON; Manufacturer Part Number 4: B3S-1000P; Manufacturer 5: OMRON; Manufacturer Part Number 5: B3S-1000; Manufacturer 6: OMRON; Manufacturer Part Number 6: B3S-1002P; Manufacturer 7: OMRON; Manufacturer Part Number 7: B3S-1002; Manufacturer 8: Switech Electronics Co. Ltd; Manufacturer Part Number 8: TS2A-043C-G9; Supplier 1: Digi-Key; Supplier Part Number 1: EG1868CT-ND; Supplier 2: Digi-Key; Supplier Part Number 2: EG1868TR-ND; Supplier 3: Digi-Key; Supplier Part Number 3: EG1867CT-ND; Supplier 4: Digi-Key; Supplier Part Number 4: SW836CT-ND; Supplier 5: Digi-Key; Supplier Part Number 5: SW415-ND; Supplier 6: Digi-Key; Supplier Part Number 6: SW837CT-ND; Supplier 7: Digi-Key; Supplier Part Number 7: SW416-ND; Supplier 8: Raynen; Supplier Part Number 8: SWIT00025C01; Quantity Override: 1
Q1 Q2 = TRA1196: Dual P-Channel MOSFET; Manufacturer 1: Diodes Incorporated; Manufacturer Part Number 1: DMP2160UFDB-7; Description_: TRANS FET DUAL P+P DMP2160 20V 3.8A 0.07ohm@2.8A&4.5V 1.4W U-DFN2020-6; Dev Tools Status: Design; Current: 3.8A; Drain to Source Voltage: 20V; Gate to Source Voltage: 900mV; Power: 1.4W; Owner: Dragos Danaila; Populated: YES; MCHP-ID: TRA1196; Revision: 1; Symbol: Transistor U-DFN2020-6-SGDSGD; Status: MCL Design; Package: U-DFN2020-6; ComponentLink1URL: https://chn-vm-apps.microchip.com/mchprepo/parts/Datasheets/ds31643.pdf; ComponentLink1Description: SVN Datasheet; ComponentLink2URL: C:\ALTIUM_WORK\00001_MCHP-CDB\Datasheets\ds31643.pdf; ComponentLink2Description: Local Datasheet; ComponentLink3URL: C:\ALTIUM_WORK\00001_MCHP-CDB\Library\LibraryRefs\Transistor U-DFN2020-6-SGDSGD.SchLib; ComponentLink3Description: Open Symbol; ComponentLink4URL: C:\ALTIUM_WORK\00001_MCHP-CDB\Library\Footprints\U-DFN2020-6_2.0x2.0.PcbLib; ComponentLink4Description: Open Footprint; ComponentLink5Description: Open Footprint 2; ComponentLink6Description: Open Footprint 3; ComponentLink7Description: Open Footprint 4; Operating Temperature: -55C to +150C; Category: Transistor; Voltage: 20V; Supplier 1: Digi-Key; Supplier Part Number 1: DMP2160UFDB-7DI-ND; Quantity Override: 1
Q6 Q7 = TRA1147: Transistor MOS; Manufacturer 1: Fairchild; Description_: TRANS FET N-CH BSS138 50V 220mA 360mW SOT-23; Dev Tools Status: Design; Type: FET; Current: 220mA; Drain to Source Voltage: 50V; Gate to Source Voltage: 1.3V; Power: 360mW; Owner: Razvan Cristescu; Populated: YES; MCHP-ID: TRA1147; Revision: A; Symbol: Transistor MOS-N GSD; Status: MCL Design; Package: SOT-23-3; ComponentLink1URL: https://chn-vm-apps.microchip.com/mchprepo/parts/Datasheets/2163920.pdf; ComponentLink1Description: SVN Datasheet; ComponentLink2URL: C:\ALTIUM_WORK\00001_MCHP-CDB\Datasheets\2163920.pdf; ComponentLink2Description: Local Datasheet; ComponentLink3URL: C:\ALTIUM_WORK\00001_MCHP-CDB\Library\LibraryRefs\Transistor MOS-N GSD.SchLib; ComponentLink3Description: Open Symbol; ComponentLink4URL: C:\ALTIUM_WORK\00001_MCHP-CDB\Library\Footprints\SOT-23-3.PcbLib; ComponentLink4Description: Open Footprint; ComponentLink5Description: Open Footprint 2; ComponentLink6Description: Open Footprint 3; ComponentLink7Description: Open Footprint 4; Operating Temperature: -55C to +150C; Category: Transistor; Voltage: 50V; Manufacturer Part Number 1: BSS138; Supplier 1: Farnell; Supplier Part Number 1: 9845330; Quantity Override: 1
R1 R8 R129 R132 = RES1011: Manufacturer 1: Panasonic; Manufacturer Part Number 1: ERJ-2RKF1003X; Description_: RES TKF 100k 1% 1/10W SMD 0402; Dev Tools Status: Production; Voltage: 50V; Temperature Coeffcient: 100ppm/C; Power: 1/10W; Owner: Tad Ahlvers; Populated: YES; MCHP-ID: RES1011; Revision: 1; Symbol: Resistor; Status: MCL Design; ComponentLink1URL: https://chn-vm-apps.microchip.com/mchprepo/parts/Datasheets/AOA0000CE2.pdf; ComponentLink1Description: SVN Datasheet; ComponentLink2URL: C:\ALTIUM_WORK\00001_MCHP-CDB\Datasheets\AOA0000CE2.pdf; ComponentLink2Description: Local Datasheet; ComponentLink3URL: C:\ALTIUM_WORK\00001_MCHP-CDB\Library\LibraryRefs\Resistor.SchLib; ComponentLink3Description: Open Symbol; ComponentLink4URL: C:\ALTIUM_WORK\00001_MCHP-CDB\Library\Footprints\RES_C_0402.PcbLib; ComponentLink4Description: Open Footprint; ComponentLink5Description: Open Footprint 2; ComponentLink6Description: Open Footprint 3; ComponentLink7Description: Open Footprint 4; Operating Temperature: -55C to +125C; Category: Resistor; Type: RES SMD; Composition: TKF; Supplier 1: Digi-Key; Supplier Part Number 1: P100KLCT-ND; Quantity Override: 1
R2 R11 = RSMT1207: Manufacturer 1: Vishay Dale; Manufacturer Part Number 1: CRCW0402309KFKED; Description_: RES TKF 309k 1% 1/16W SMD 0402; Dev Tools Status: Design; Voltage: 50V; Temperature Coeffcient: 100ppm/C; Power: 1/16W; Owner: Dragos Danaila; Populated: YES; MCHP-ID: RSMT1207; Revision: A; Symbol: Resistor; Status: MCL Design; ComponentLink1URL: https://chn-vm-apps.microchip.com/mchprepo/parts/Datasheets/dcrcwe3.pdf; ComponentLink1Description: SVN Datasheet; ComponentLink2URL: C:\ALTIUM_WORK\00001_MCHP-CDB\Datasheets\dcrcwe3.pdf; ComponentLink2Description: Local Datasheet; ComponentLink3URL: C:\ALTIUM_WORK\00001_MCHP-CDB\Library\LibraryRefs\Resistor.SchLib; ComponentLink3Description: Open Symbol; ComponentLink4URL: C:\ALTIUM_WORK\00001_MCHP-CDB\Library\Footprints\RES_C_0402.PcbLib; ComponentLink4Description: Open Footprint; ComponentLink5Description: Open Footprint 2; ComponentLink6Description: Open Footprint 3; ComponentLink7Description: Open Footprint 4; Operating Temperature: -55C to +155C; Category: Resistor; Type: RES SMD; Composition: TKF; Supplier 1: Digi-Key; Supplier Part Number 1: 541-309KLDKR-ND; Quantity Override: 1
R3 R10 R13 R16 R18 R26 R121 R127 R128 = RSMT0439: Manufacturer 1: Vishay; Manufacturer Part Number 1: CRCW040210K0JNED; Description_: RES TKF 10k 5% 1/16W SMD 0402; Dev Tools Status: Production; Voltage: 50V; Temperature Coeffcient: 100ppm/C; Power: 1/16W; Populated: Yes; MCHP-ID: RSMT0439; Revision: 1; Symbol: Resistor; Status: MCL Design; ComponentLink1URL: https://chn-vm-apps.microchip.com/mchprepo/parts/Datasheets/PYu-RC0402_51_RoHS_L_6.pdf; ComponentLink1Description: SVN Datasheet; ComponentLink2URL: C:\ALTIUM_WORK\00001_MCHP-CDB\Datasheets\PYu-RC0402_51_RoHS_L_6.pdf; ComponentLink2Description: Local Datasheet; ComponentLink3URL: C:\ALTIUM_WORK\00001_MCHP-CDB\Library\LibraryRefs\Resistor.SchLib; ComponentLink3Description: Open Symbol; ComponentLink4URL: C:\ALTIUM_WORK\00001_MCHP-CDB\Library\Footprints\RES_C_0402.PcbLib; ComponentLink4Description: Open Footprint; ComponentLink5Description: Open Footprint 2; ComponentLink6Description: Open Footprint 3; ComponentLink7Description: Open Footprint 4; Operating Temperature: -55C to +155C; Category: Resistor; Type: RES SMD; Composition: TKF; Manufacturer 2: Yageo; Manufacturer Part Number 2: RC0402JR-0710KL; Supplier 1: Digi-Key; Supplier Part Number 1: 541-10KJCT-ND; Supplier 2: Digi-Key; Supplier Part Number 2: 311-10KJRCT-ND; Quantity Override: 1
R4 R20 R23 R24 = RSMT1038: Manufacturer 1: Yageo; Manufacturer Part Number 1: RC0402JR-07100RL; Description_: RES TKF 100R 5% 1/16W SMD 0402; Dev Tools Status: Production; Voltage: 50V; Temperature Coeffcient: 100ppm/C; Power: 1/16W; Owner: Sompoch Loboonlert; Populated: Yes; MCHP-ID: RSMT1038; Revision: 2; Symbol: Resistor; Status: MCL Design; ComponentLink1URL: https://chn-vm-apps.microchip.com/mchprepo/parts/Datasheets/PYu-RC0402_51_RoHS_L_6.pdf; ComponentLink1Description: SVN Datasheet; ComponentLink2URL: C:\ALTIUM_WORK\00001_MCHP-CDB\Datasheets\PYu-RC0402_51_RoHS_L_6.pdf; ComponentLink2Description: Local Datasheet; ComponentLink3URL: C:\ALTIUM_WORK\00001_MCHP-CDB\Library\LibraryRefs\Resistor.SchLib; ComponentLink3Description: Open Symbol; ComponentLink4URL: C:\ALTIUM_WORK\00001_MCHP-CDB\Library\Footprints\RES_C_0402.PcbLib; ComponentLink4Description: Open Footprint; ComponentLink5Description: Open Footprint 2; ComponentLink6Description: Open Footprint 3; ComponentLink7Description: Open Footprint 4; Operating Temperature: -55C to +155C; Category: Resistor; Type: RES SMD; Composition: TKF; Supplier 1: Digi-Key; Supplier Part Number 1: 311-100JRCT-ND; Quantity Override: 1
R5 R14 = RSMT1208: Manufacturer 1: Vishay Dale; Manufacturer Part Number 1: CRCW040271K5FKED; Description_: RES TKF 71.5k 1% 1/16W SMD 0402; Dev Tools Status: Design; Voltage: 50V; Temperature Coeffcient: 100ppm/C; Power: 1/16W; Owner: Dragos Danaila; Populated: YES; MCHP-ID: RSMT1208; Revision: A; Symbol: Resistor; Status: MCL Design; ComponentLink1URL: https://chn-vm-apps.microchip.com/mchprepo/parts/Datasheets/dcrcwe3.pdf; ComponentLink1Description: SVN Datasheet; ComponentLink2URL: C:\ALTIUM_WORK\00001_MCHP-CDB\Datasheets\dcrcwe3.pdf; ComponentLink2Description: Local Datasheet; ComponentLink3URL: C:\ALTIUM_WORK\00001_MCHP-CDB\Library\LibraryRefs\Resistor.SchLib; ComponentLink3Description: Open Symbol; ComponentLink4URL: C:\ALTIUM_WORK\00001_MCHP-CDB\Library\Footprints\RES_C_0402.PcbLib; ComponentLink4Description: Open Footprint; ComponentLink5Description: Open Footprint 2; ComponentLink6Description: Open Footprint 3; ComponentLink7Description: Open Footprint 4; Operating Temperature: -55C to +155C; Category: Resistor; Type: RES SMD; Composition: TKF; Supplier 1: Digi-Key; Supplier Part Number 1: 541-71.5KLTR-ND; Quantity Override: 1
R6 = RSMT1209: Manufacturer 1: Vishay Dale; Manufacturer Part Number 1: CRCW0402301KFKED; Description_: RES TKF 301k 1% 1/16W SMD 0402; Dev Tools Status: Design; Voltage: 50; Temperature Coeffcient: 100ppm/C; Power: 1/16W; Owner: Dragos Danaila; Populated: YES; MCHP-ID: RSMT1209; Revision: A; Symbol: Resistor; Status: MCL Design; ComponentLink1URL: https://chn-vm-apps.microchip.com/mchprepo/parts/Datasheets/dcrcwe3.pdf; ComponentLink1Description: SVN Datasheet; ComponentLink2URL: C:\ALTIUM_WORK\00001_MCHP-CDB\Datasheets\dcrcwe3.pdf; ComponentLink2Description: Local Datasheet; ComponentLink3URL: C:\ALTIUM_WORK\00001_MCHP-CDB\Library\LibraryRefs\Resistor.SchLib; ComponentLink3Description: Open Symbol; ComponentLink4URL: C:\ALTIUM_WORK\00001_MCHP-CDB\Library\Footprints\RES_C_0402.PcbLib; ComponentLink4Description: Open Footprint; ComponentLink5Description: Open Footprint 2; ComponentLink6Description: Open Footprint 3; ComponentLink7Description: Open Footprint 4; Operating Temperature: -55C to +155C; Category: Resistor; Type: RES SMD; Composition: TKF; Supplier 1: Digi-Key; Supplier Part Number 1: 541-301KLDKR-ND; Quantity Override: 1
R7 R15 = RSMT0439: Manufacturer 1: Vishay; Manufacturer Part Number 1: CRCW040210K0JNED; Description_: RES TKF 10k 5% 1/16W SMD 0402; Dev Tools Status: Production; Voltage: 50V; Temperature Coeffcient: 100ppm/C; Power: 1/16W; Populated: DNP; MCHP-ID: RSMT0439; Revision: 1; Symbol: Resistor; Status: MCL Design; ComponentLink1URL: https://chn-vm-apps.microchip.com/mchprepo/parts/Datasheets/PYu-RC0402_51_RoHS_L_6.pdf; ComponentLink1Description: SVN Datasheet; ComponentLink2URL: C:\ALTIUM_WORK\00001_MCHP-CDB\Datasheets\PYu-RC0402_51_RoHS_L_6.pdf; ComponentLink2Description: Local Datasheet; ComponentLink3URL: C:\ALTIUM_WORK\00001_MCHP-CDB\Library\LibraryRefs\Resistor.SchLib; ComponentLink3Description: Open Symbol; ComponentLink4URL: C:\ALTIUM_WORK\00001_MCHP-CDB\Library\Footprints\RES_C_0402.PcbLib; ComponentLink4Description: Open Footprint; ComponentLink5Description: Open Footprint 2; ComponentLink6Description: Open Footprint 3; ComponentLink7Description: Open Footprint 4; Operating Temperature: -55C to +155C; Category: Resistor; Type: RES SMD; Composition: TKF; Manufacturer 2: Yageo; Manufacturer Part Number 2: RC0402JR-0710KL; Supplier 1: Digi-Key; Supplier Part Number 1: 541-10KJCT-ND; Supplier 2: Digi-Key; Supplier Part Number 2: 311-10KJRCT-ND; Quantity Override: 1
R9 = RSMT1210: Manufacturer 1: Vishay Dale; Manufacturer Part Number 1: CRCW0402158KFKED; Description_: RES TKF 158k 1% 1/16W SMD 0402; Dev Tools Status: Design; Voltage: 50V; Temperature Coeffcient: 100ppm/C; Power: 1/16W; Owner: Dragos Danaila; Populated: YES; MCHP-ID: RSMT1210; Revision: A; Symbol: Resistor; Status: MCL Design; ComponentLink1URL: https://chn-vm-apps.microchip.com/mchprepo/parts/Datasheets/dcrcwe3.pdf; ComponentLink1Description: SVN Datasheet; ComponentLink2URL: C:\ALTIUM_WORK\00001_MCHP-CDB\Datasheets\dcrcwe3.pdf; ComponentLink2Description: Local Datasheet; ComponentLink3URL: C:\ALTIUM_WORK\00001_MCHP-CDB\Library\LibraryRefs\Resistor.SchLib; ComponentLink3Description: Open Symbol; ComponentLink4URL: C:\ALTIUM_WORK\00001_MCHP-CDB\Library\Footprints\RES_C_0402.PcbLib; ComponentLink4Description: Open Footprint; ComponentLink5Description: Open Footprint 2; ComponentLink6Description: Open Footprint 3; ComponentLink7Description: Open Footprint 4; Operating Temperature: -55C to +155C; Category: Resistor; Type: RES SMD; Composition: TKF; Supplier 1: Digi-Key; Supplier Part Number 1: 541-158KLCT-ND; Quantity Override: 1
R12 R126 = RES1011: Manufacturer 1: Panasonic; Manufacturer Part Number 1: ERJ-2RKF1003X; Description_: RES TKF 100k 1% 1/10W SMD 0402; Dev Tools Status: Production; Voltage: 50V; Temperature Coeffcient: 100ppm/C; Power: 1/10W; Owner: Tad Ahlvers; Populated: DNP; MCHP-ID: RES1011; Revision: 1; Symbol: Resistor; Status: MCL Design; ComponentLink1URL: https://chn-vm-apps.microchip.com/mchprepo/parts/Datasheets/AOA0000CE2.pdf; ComponentLink1Description: SVN Datasheet; ComponentLink2URL: C:\ALTIUM_WORK\00001_MCHP-CDB\Datasheets\AOA0000CE2.pdf; ComponentLink2Description: Local Datasheet; ComponentLink3URL: C:\ALTIUM_WORK\00001_MCHP-CDB\Library\LibraryRefs\Resistor.SchLib; ComponentLink3Description: Open Symbol; ComponentLink4URL: C:\ALTIUM_WORK\00001_MCHP-CDB\Library\Footprints\RES_C_0402.PcbLib; ComponentLink4Description: Open Footprint; ComponentLink5Description: Open Footprint 2; ComponentLink6Description: Open Footprint 3; ComponentLink7Description: Open Footprint 4; Operating Temperature: -55C to +125C; Category: Resistor; Type: RES SMD; Composition: TKF; Supplier 1: Digi-Key; Supplier Part Number 1: P100KLCT-ND; Quantity Override: 1
R17 R19 R21 R22 R131 = RSMT0730: Manufacturer 1: Panasonic; Manufacturer Part Number 1: ERJ-2GE0R00X; Description_: RES TKF 0R SMD 0402; Dev Tools Status: Production; Power: 1/10W; Populated: DNP; MCHP-ID: RSMT0730; Revision: 2; Symbol: Resistor; Status: MCL Design; ComponentLink1URL: https://chn-vm-apps.microchip.com/mchprepo/parts/Datasheets/AOA0000CE1.pdf; ComponentLink1Description: SVN Datasheet; ComponentLink2URL: C:\ALTIUM_WORK\00001_MCHP-CDB\Datasheets\AOA0000CE1.pdf; ComponentLink2Description: Local Datasheet; ComponentLink3URL: C:\ALTIUM_WORK\00001_MCHP-CDB\Library\LibraryRefs\Resistor.SchLib; ComponentLink3Description: Open Symbol; ComponentLink4URL: C:\ALTIUM_WORK\00001_MCHP-CDB\Library\Footprints\RES_C_0402.PcbLib; ComponentLink4Description: Open Footprint; ComponentLink5Description: Open Footprint 2; ComponentLink6Description: Open Footprint 3; ComponentLink7Description: Open Footprint 4; Operating Temperature: -55C to +155C; Category: Resistor; Type: RES SMD; Composition: TKF; Manufacturer 2: Vishay; Manufacturer Part Number 2: CRCW04020000Z0ED; Supplier 1: Digi-Key; Supplier Part Number 1: P0.0JCT-ND; Supplier 2: Digi-Key; Supplier Part Number 2: 541-0.0JTR-ND; Quantity Override: 1
R25 R130 = RSMT0730: Manufacturer 1: Panasonic; Manufacturer Part Number 1: ERJ-2GE0R00X; Description_: RES TKF 0R SMD 0402; Dev Tools Status: Production; Power: 1/10W; Populated: Yes; MCHP-ID: RSMT0730; Revision: 2; Symbol: Resistor; Status: MCL Design; ComponentLink1URL: https://chn-vm-apps.microchip.com/mchprepo/parts/Datasheets/AOA0000CE1.pdf; ComponentLink1Description: SVN Datasheet; ComponentLink2URL: C:\ALTIUM_WORK\00001_MCHP-CDB\Datasheets\AOA0000CE1.pdf; ComponentLink2Description: Local Datasheet; ComponentLink3URL: C:\ALTIUM_WORK\00001_MCHP-CDB\Library\LibraryRefs\Resistor.SchLib; ComponentLink3Description: Open Symbol; ComponentLink4URL: C:\ALTIUM_WORK\00001_MCHP-CDB\Library\Footprints\RES_C_0402.PcbLib; ComponentLink4Description: Open Footprint; ComponentLink5Description: Open Footprint 2; ComponentLink6Description: Open Footprint 3; ComponentLink7Description: Open Footprint 4; Operating Temperature: -55C to +155C; Category: Resistor; Type: RES SMD; Composition: TKF; Manufacturer 2: Vishay; Manufacturer Part Number 2: CRCW04020000Z0ED; Supplier 1: Digi-Key; Supplier Part Number 1: P0.0JCT-ND; Supplier 2: Digi-Key; Supplier Part Number 2: 541-0.0JTR-ND; Quantity Override: 1
U1 = MIC6961: MCHP ANALOG SWITCHER Buck 1V MIC23451-AAAYFL VQFN-26; Manufacturer 1: Microchip; Dev Tools Status: Design; Owner: Razvan Cristescu; Populated: YES; MCHP-ID: MIC6961; Description_: MCHP ANALOG SWITCHER Buck 1V MIC23451-AAAYFL VQFN-26; Symbol: MIC23451 VQFN-26; Type: Switcher; Status: MCL Design; Revision: A; Category: MCHP-Analog; ComponentLink1Description: SVN Datasheet; ComponentLink2URL: C:\ALTIUM_WORK\00001_MCHP-CDB\Datasheets\MIC23451.pdf; ComponentLink2Description: Local Datasheet; ComponentLink3URL: C:\ALTIUM_WORK\00001_MCHP-CDB\Library\LibraryRefs\MIC23451 VQFN-26.SchLib; ComponentLink3Description: Open Symbol; ComponentLink4URL: C:\ALTIUM_WORK\00001_MCHP-CDB\Library\Footprints\VQFN-26_4X4_MIC23451.PcbLib; ComponentLink4Description: Open Footprint; ComponentLink5Description: Open Footprint 2; ComponentLink6Description: Open Footprint 3; ComponentLink7Description: Open Footprint 4; Manufacturer Part Number 1: MIC23451-AAAYFL; Supplier 1: Microchip; Supplier Part Number 1: MIC23451-AAAYFL; Quantity Override: 1
U2 = ic1435: IC SWITCHER ADG849 Analog Switch SC70; Manufacturer 1: Analog Devices Inc.; Manufacturer Part Number 1: ADG849YKSZ-REEL7; MCHP-ID: IC1435; Dev Tools Status: Design; Vin: 5V; Owner: Dragos Danaila; Populated: YES; Revision: A; Symbol: ADG849 SC70; Description_: IC SWITCHER ADG849 Analog Switch SC70; Status: MCL Design; Package: SC-70-6; ComponentLink1URL: https://chn-vm-apps.microchip.com/mchprepo/parts/Datasheets/ADG849.pdf; ComponentLink1Description: SVN Datasheet; ComponentLink2URL: C:\ALTIUM_WORK\00001_MCHP-CDB\Datasheets\ADG849.pdf; ComponentLink2Description: Local Datasheet; ComponentLink3URL: C:\ALTIUM_WORK\00001_MCHP-CDB\Library\LibraryRefs\ADG849 SC70.SchLib; ComponentLink3Description: Open Symbol; ComponentLink4URL: C:\ALTIUM_WORK\00001_MCHP-CDB\Library\Footprints\SC-70-6.PcbLib; ComponentLink4Description: Open Footprint; ComponentLink5Description: Open Footprint 2; ComponentLink6Description: Open Footprint 3; ComponentLink7Description: Open Footprint 4; Operating Temperature: -40C to +125C; Category: IC; Supplier 1: Digi-Key; Supplier Part Number 1: ADG849YKSZ-REEL7CT-ND; Quantity Override: 1